# Altium project Zapper.PrjPcb (part 2 of 3)

## Sheet OutputChannel.SchDoc
size A4; DocumentNumber: 5; SheetNumber: 5; SheetTotal: 7
Used 8 times, as channels U_OutputChannel1, U_OutputChannel2, U_OutputChannel3, U_OutputChannel4, U_OutputChannel5, U_OutputChannel6, U_OutputChannel7, U_OutputChannel8. Parts and nets are listed once, with the designators drawn on the sheet.
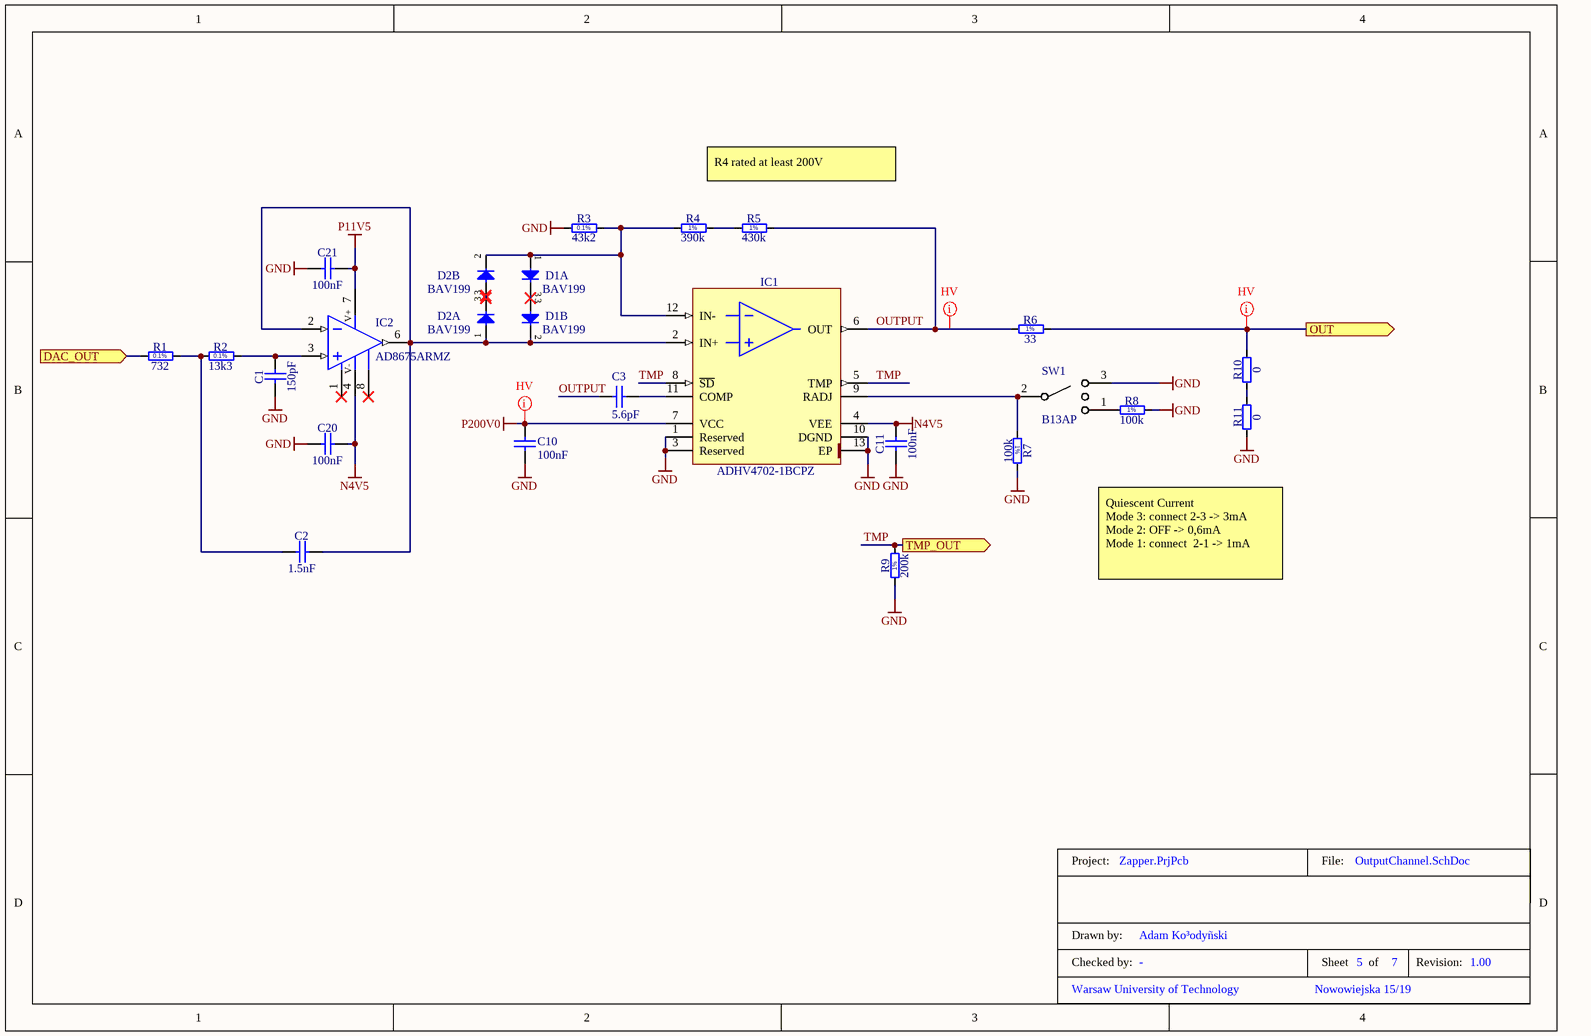
[diagram p4: OutputChannel.SchDoc]

### Parts
C1  150pF  [CAPC1608X87N]
C2  1.5nF  [CAPC1608X87N]
C3  5.6pF  [CAPC2012X95N - HV]
C10  100nF  [CAPC2012X125 - HV]
C11  100nF  [CAPC1005X55N]
C20  100nF  [CAPC1005X55N]
C21  100nF  [CAPC1005X55N]
D1  BAV199  [SOT95P240X110-3N]  (parts A,B of 2)
D2  BAV199  [SOT95P240X110-3N]  (parts A,B of 2)
IC1  ADHV4702-1BCPZ  [QFN170P700X700X80-13N-S290]
IC2  AD8675ARMZ  [SOP65P490X110-8N]
R1  732  [RESC1608X55N]
R2  13k3  [RESC1608X55N]
R3  43k2  [RESC1608X55N]
R4  390k  [RESC2012X60N]
R5  430k  [RESC2012X60N]
R6  33  [RESC1608X55N]
R7  100k  [RESC1608X55N]
R8  100k  [RESC1608X55N]
R9  200k  [RESC1608X55N]
R10  0  [RESC2012X60N]
R11  0  [RESC2012X60N]
SW1  B13AP  [B13AP]
TitleBlock5  TitleBlock  (value not drawn)  (graphical)

### Ports
DAC_OUT (in), OUT (out), TMP_OUT (out)

### Nets
GND: C1.1 C10.1 C11.1 C20.1 C21.1 IC1.1(Reserved) IC1.3(Reserved) IC1.10(DGND) IC1.13(EP) R3.1 R7.2 R8.2 R9.1 R11.1 SW1.3(NC)
N4V5: C11.2 C20.2 IC1.4(VEE) IC2.4(V-)
P11V5: C21.2 IC2.7(V+)
P200V0: C10.2 IC1.7(VCC)
DAC_OUT: R1.1 ; port DAC_OUT
OUT: R6.2 R10.2 ; port OUT
OUTPUT: C3.2 IC1.6(OUT) R5.2 R6.1
TMP: IC1.5(TMP) IC1.8(~{SD}) R9.2 ; port TMP_OUT
NetC1_2: C1.2 IC2.3(IN+) R2.2
NetC2_1: C2.1 R1.2 R2.1
NetC2_2: C2.2 D1.2(C) D2.1(A) IC1.2(IN+) IC2.2(IN-) IC2.6(OUT)
NetC3_1: C3.1 IC1.11(COMP)
NetD1_1: D1.1(A) D2.2(C) IC1.12(IN-) R3.2 R4.1
NetIC1_9: IC1.9(RADJ) R7.1 SW1.2(C)
NetR4_2: R4.2 R5.1
NetR8_1: R8.1 SW1.1(NO)
NetR10_1: R10.1 R11.2

Not connected (* = marked no-connect by the designer): D1 3(COMAC)*; D2 3(COMAC)*; IC2 1(OFFSET)* 8(OFFSET)*

### Channels
U_OutputChannel1: designators end in _U_OutputChannel1; ports DAC_OUT=VOUT1 OUT=Channel_OUT1 TMP_OUT=Channel_TMP1
U_OutputChannel2: designators end in _U_OutputChannel2; ports DAC_OUT=VOUT2 OUT=Channel_OUT2 TMP_OUT=Channel_TMP2
U_OutputChannel3: designators end in _U_OutputChannel3; ports DAC_OUT=VOUT3 OUT=Channel_OUT3 TMP_OUT=Channel_TMP3
U_OutputChannel4: designators end in _U_OutputChannel4; ports DAC_OUT=VOUT4 OUT=Channel_OUT4 TMP_OUT=Channel_TMP4
U_OutputChannel5: designators end in _U_OutputChannel5; ports DAC_OUT=VOUT5 OUT=Channel_OUT5 TMP_OUT=Channel_TMP5
U_OutputChannel6: designators end in _U_OutputChannel6; ports DAC_OUT=VOUT6 OUT=Channel_OUT6 TMP_OUT=Channel_TMP6
U_OutputChannel7: designators end in _U_OutputChannel7; ports DAC_OUT=VOUT7 OUT=Channel_OUT7 TMP_OUT=Channel_TMP7
U_OutputChannel8: designators end in _U_OutputChannel8; ports DAC_OUT=VOUT8 OUT=Channel_OUT8 TMP_OUT=Channel_TMP8

### Layout directives
net class HighVoltage: Channel_OUT1, OUTPUT_U_OutputChannel1, P200V0

### Notes on the sheet
- R4 rated at least 200V
- Quiescent Current                    Mode 3: connect 2-3 -> 3mA   Mode 2: OFF -> 0,6mA               Mode 1: connect  2-1 -> 1mA
- (in symbol R0603_13K3_0.1%_0.063W_10PPM) 0.1%
- (in symbol R0603_33R_1%_0.1W_100PPM) 1%
- (in symbol R0603_43K2_0.1%_0.063W_10PPM) 0.1%
- (in symbol R0603_100K_1%_0.1W_100PPM) 1%
- (in symbol R0603_200K_1%_0.1W_100PPM) 1%
- (in symbol R0603_732R_0.1%_0.063W_10PPM) 0.1%
- (in symbol R0805_390K_1%_0.125W_100PPM) 1%
- (in symbol R0805_430K_1%_0.125W_100PPM) 1%
- (in symbol TitleBlock) Project:; File:; Drawn by:; Checked by:; Sheet; of; Revision:

### Library data of the parts
C1 = CC0603_150PF_50V_1%_NP0: Non-polarised capacitor; Part Description: SMD Multilayer Chip Ceramic Capacitor; Manufacturer: GENERIC; Manufacturer1 Part Number: CC0603FRNPO9BN151; Voltage: 50V; TC: C0G/NP0; Tolerance: ±1%; Part Number: CC0603_150PF_50V_1%_NP0; Component Kind: Standard; Component Type: Standard; Pin Count: 2; Value: 150pF; Status: None; Manufacturer Part Number: CC0603_150PF_50V_1%_NP0; Case: 0603; Mounted: Yes; Socket: No; SMD: Yes; Sense: No; Manufacturer1 Example: PHYCOMP; Manufacturer1 ComponentHeight: 0.7mm; HelpURL: \\cern.ch\dfs\Applications\Altium\Datasheets\CC0805_NP0_PHYCOMP_16VTO50V.pdf; Author: CERN DEM MR; CreateDate: 17.02.2016; LatestRevisionDate: 17.02.2016
C2 = CC0603_1.5NF_50V_10%_X7R: Non-polarised capacitor; Part Description: SMD Multilayer Chip Ceramic Capacitor; Manufacturer: GENERIC; Manufacturer1 Part Number: 223858615625; Voltage: 50V; TC: X7R; Tolerance: ±10%; Part Number: CC0603_1.5NF_50V_10%_X7R; Component Kind: Standard; Component Type: Standard; Pin Count: 2; Value: 1.5nF; Status: Preferred; Manufacturer Part Number: CC0603_1.5NF_50V_10%_X7R; Case: 0603; Mounted: Yes; Socket: No; SMD: Yes; Sense: No; Manufacturer1 Example: PHYCOMP; Manufacturer1 ComponentHeight: 0.87mm; HelpURL: \\cern.ch\dfs\Applications\Altium\Datasheets\CC0603_X7R_PHYCOMP.pdf; Author: CERN DEM JLC; CreateDate: 03.12.2007; LatestRevisionDate: 03.12.2007
C3 = CBR08C569CAGAC: CAP CER 5.6PF 250V C0G/NP0 0805; Manufacturer 1: KEMET; Dielectric: C0G; Supplier 1: Mouser; Manufacturer Part Number 1: CBR08C569CAGAC; Stock 1: 9135; Pricing 1: 1=1,05000, 10=0,74500, 100=0,47000, 500=0,42300, 1000=0,38500, 4000=0,31800 (USD); RoHS: Yes; Mount: Surface Mount; Case/Package: 0805; Weight: 0.000194oz; Case Code (Metric): 2012; Case Code (Imperial): 0805; Min Operating Temperature: -55°C; Max Operating Temperature: 125°C; Packaging: Tape and Reel; Package Quantity: 1; Capacitance: 5.6pF; Voltage Rating: 250V; Voltage Rating (DC): 250V; Termination: SMD/SMT; Length: 0.079inch; Height: 0.85mm; Width: 0.049inch; Thickness: 0.035inch; ComponentLink1URL: https://datasheet.ciiva.com/6258/kem-c1030-cbr-smd-6258011.pdf?src-supplier=Digi-Key; ComponentLink1Description: https://datasheet.ciiva.com/6258/kem-c1030-cbr-smd-6258011.pdf?src-supplier=Digi-Key; ComponentLink2URL: https://datasheet.ciiva.com/6258/kem-c1030-cbr-smd-6258013.pdf?src-supplier=Digi-Key; ComponentLink2Description: https://datasheet.ciiva.com/6258/kem-c1030-cbr-smd-6258013.pdf?src-supplier=Digi-Key; ComponentLink3URL: https://datasheet.ciiva.com/6258/kem-c1030-cbr-smd-6258015.pdf?src-supplier=Digi-Key; ComponentLink3Description: https://datasheet.ciiva.com/6258/kem-c1030-cbr-smd-6258015.pdf?src-supplier=Digi-Key; Supplier Part Number 1: 80-CBR08C569CAG
C10 = C2012X7T2E104K125AA: CAP CER 100nF 250V  TDK         C2012X7T2E104K125AA             SMD Multilayer Ceramic Capacitor, 0805 [2012 Metric], 10%, X7T, C Series                          New; Supplier 1: Digi-Key; Manufacturer 1: TDK; Manufacturer Part Number 1: C2012X7T2E104K125AA; Stock 1: 145107; Pricing 1: 1=0,32000, 10=0,21800, 50=0,14520, 100=0,12340, 500=0,08712, 1000=0,07623 (USD); RoHS: Yes; Mount: Surface Mount; Case/Package: 0805; Case Code (Imperial): 0805; Case Code (Metric): 2012; Min Operating Temperature: -55°C; Max Operating Temperature: 125°C; Dielectric: X7T; Capacitance: 100nF; Tolerance: 10%; Voltage Rating (DC): 250V; Package Quantity: 1; Voltage Rating: 250V; Packaging: Tape and Reel; Length: 2mm; Height: 1.25mm; Thickness: 0.057inch; Depth: 1.25mm; Width: 0.049inch; Radiation Hardening: No; Lead Free: Lead Free; REACH SVHC: No SVHC; ComponentLink1URL: http://components.arrow.com/part/dataview/0323_06886774?src-supplier=Arrow+Europe; ComponentLink1Description: http://components.arrow.com/part/dataview/0323_06886774?src-supplier=Arrow+Europe; ComponentLink2URL: https://product.tdk.com/info/en/catalog/datasheets/mlcc_commercial_midvoltage_en.pdf?src-supplier=Digi-Key; ComponentLink2Description: https://product.tdk.com/info/en/catalog/datasheets/mlcc_commercial_midvoltage_en.pdf?src-supplier=Digi-Key; ComponentLink3URL: http://components.arrow.com/part/dataview/57434366S459809N1165?src-supplier=Arrow; ComponentLink3Description: http://components.arrow.com/part/dataview/57434366S459809N1165?src-supplier=Arrow; ComponentLink4URL: http://product.tdk.com/capacitor/mlcc/en/documents/mlcc_commercial_midvoltage_en.pdf?src-supplier=Avnet; ComponentLink4Description: http://product.tdk.com/capacitor/mlcc/en/documents/mlcc_commercial_midvoltage_en.pdf?src-supplier=Avnet; ComponentLink5URL: http://product.tdk.com/capacitor/mlcc/en/documents/mlcc_commercial_midvoltage_en.pdf?src-supplier=Avnet+Europe; ComponentLink5Description: http://product.tdk.com/capacitor/mlcc/en/documents/mlcc_commercial_midvoltage_en.pdf?src-supplier=Avnet+Europe; ComponentLink6URL: http://www.farnell.com/datasheets/1913358.pdf?src-supplier=Element14; ComponentLink6Description: http://www.farnell.com/datasheets/1913358.pdf?src-supplier=Element14; ComponentLink7URL: https://product.tdk.com/info/en/catalog/spec/mlccspec_commercial_general_midvoltage_en.pdf?src-supplier=Digi-Key; ComponentLink7Description: https://product.tdk.com/info/en/catalog/spec/mlccspec_commercial_general_midvoltage_en.pdf?src-supplier=Digi-Key; ComponentLink8URL: http://www.farnell.com/datasheets/1913358.pdf?src-supplier=Newark; ComponentLink8Description: http://www.farnell.com/datasheets/1913358.pdf?src-supplier=Newark; Supplier Part Number 1: 445-C2012X7T2E104K125AACT-ND
C11 C20 C21 = CC0402_100NF_16V_10%_X7R: Non-polarised capacitor; Part Description: SMD Multilayer Chip Ceramic Capacitor; Manufacturer: GENERIC; Manufacturer1 Part Number: GRM155R71C104KA88D; Voltage: 16V; TC: X7R; Tolerance: ±10%; Part Number: CC0402_100NF_16V_10%_X7R; Component Kind: Standard; Component Type: Standard; Pin Count: 2; Value: 100nF; Status: Not Recommended; Manufacturer Part Number: CC0402_100NF_16V_10%_X7R; Case: 0402; Mounted: Yes; Socket: No; SMD: Yes; Sense: No; Manufacturer1 Example: MURATA; Manufacturer1 ComponentHeight: 0.55mm; HelpURL: \\cern.ch\dfs\Applications\Altium\Datasheets\CC0402_X7R_MURATA_GRM.pdf; Author: CERN DEM JLC; CreateDate: 05.12.2013; LatestRevisionDate: 03.12.2007
D1 D2 = BAV199: Serial Diode; Part Description: Low-Leakage Double Diode; Manufacturer: NXP SEMICONDUCTORS; Voltage: 75V; Power: 250mW; PressFit: No; Bonding: No; Part Number: BAV199; Component Kind: Standard; Component Type: Standard; Device: BAV199; PackageDescription: SOT23 3-Leads, Pitch 0.95mm - Body 1.4x3mm, IPC Medium Density; Manufacturer Part Number: BAV199; Pin Count: 3; Case: SOT23-3; Mounted: Yes; Socket: No; SMD: Yes; Sense: No; ComponentHeight: 1.1mm; HelpURL: \\cern.ch\dfs\Applications\Altium\Datasheets\BAV199.pdf; Author: CERN DEM JMW; CreateDate: 21.11.2008; LatestRevisionDate: 21.11.2008
IC1 = ADHV4702-1BCPZ: 24V to 220V Precision Operational Amplifier; Manufacturer: ANALOG DEVICES; PressFit: No; Bonding: No; Part Number: ADHV4702-1BCPZ; Component Kind: Standard; Component Type: Standard; Device: ADHV4702-1BCPZ; PackageDescription: QFN, 1.70mm Pitch, Square; 12 pin, 7.00mm L X 7.00mm W X 0.80mm H body (w/Thermal Tab 2.9 X 2.9mm), IPC Medium Density; Part Description: 24V to 220V Precision Operational Amplifier; Manufacturer Part Number: ADHV4702-1BCPZ; Pin Count: 13; Case: QFN12; Mounted: Yes; Socket: No; SMD: Yes; Sense: No; ComponentHeight: 0.8mm; Author: CERN DEM BC; HelpURL: \\cern.ch\dfs\Applications\Altium\Datasheets\ADHV4702-1BCPZ.pdf; CreateDate: 29.08.2019; LatestRevisionDate: 29.08.2019
IC2 = AD8675ARMZ: Operational Amplifier with Offset 1-8; Part Description: 36V Precision, 2.8nV/sqrt Hz Rail-to-Rail Output Operational Amplifier; Manufacturer: ANALOG DEVICES; PressFit: No; Bonding: No; Part Number: AD8675ARMZ; Component Kind: Standard; Component Type: Standard; Device: AD8675ARMZ; PackageDescription: SOP, 0.65mm Pitch; 8 Pin, 3.00mm W X 3.00mm L X 1.10mm H body, IPC Medium Density; Manufacturer Part Number: AD8675ARMZ; Pin Count: 8; Case: MSOP8; Mounted: Yes; Socket: No; SMD: Yes; Sense: No; ComponentHeight: 1.1mm; Author: CERN DEM JMW; HelpURL: \\cern.ch\dfs\Applications\Altium\Datasheets\AD8675ARMZ.pdf; CreateDate: 06.09.2011; LatestRevisionDate: 06.09.2011
R1 = R0603_732R_0.1%_0.063W_10PPM: Resistor - 0.1%; Part Description: Thin Film Chip Resistor; Manufacturer: GENERIC; Manufacturer1 Part Number: RN73C1J732RBTDF; Power: 0.063W; TC: ±10ppm; PressFit: No; Part Number: R0603_732R_0.1%_0.063W_10PPM; Component Kind: Standard; Component Type: Standard; Pin Count: 2; Value: 732; Status: Not Recommended; Tolerance: ±0.1%; Manufacturer Part Number: R0603_732R_0.1%_0.063W_10PPM; Case: 0603; Mounted: Yes; Sense: No; Socket: No; SMD: Yes; Manufacturer1 Example: TYCO HOLSWORTHY; Manufacturer1 ComponentHeight: 0.5mm; HelpURL: \\cern.ch\dfs\Applications\Altium\Datasheets\R0603_Tyco_RN73.pdf; Author: CERN DEM JLC; CreateDate: 03.12.2007; LatestRevisionDate: 13.03.2008
R2 = R0603_13K3_0.1%_0.063W_10PPM: Resistor - 0.1%; Part Description: Thin Film Chip Resistor; Manufacturer: GENERIC; Manufacturer1 Part Number: RN73C1J13K3BTDF; Power: 0.063W; TC: ±10ppm; PressFit: No; Part Number: R0603_13K3_0.1%_0.063W_10PPM; Component Kind: Standard; Component Type: Standard; Pin Count: 2; Value: 13k3; Status: Not Recommended; Tolerance: ±0.1%; Manufacturer Part Number: R0603_13K3_0.1%_0.063W_10PPM; Case: 0603; Mounted: Yes; Sense: No; Socket: No; SMD: Yes; Manufacturer1 Example: TYCO HOLSWORTHY; Manufacturer1 ComponentHeight: 0.5mm; HelpURL: \\cern.ch\dfs\Applications\Altium\Datasheets\R0603_Tyco_RN73.pdf; Author: CERN DEM JLC; CreateDate: 03.12.2007; LatestRevisionDate: 13.03.2008
R3 = R0603_43K2_0.1%_0.063W_10PPM: Resistor - 0.1%; Part Description: Thin Film Chip Resistor; Manufacturer: GENERIC; Manufacturer1 Part Number: RN73C1J43K2BTDF; Power: 0.063W; TC: ±10ppm; PressFit: No; Part Number: R0603_43K2_0.1%_0.063W_10PPM; Component Kind: Standard; Component Type: Standard; Pin Count: 2; Value: 43k2; Status: Not Recommended; Tolerance: ±0.1%; Manufacturer Part Number: R0603_43K2_0.1%_0.063W_10PPM; Case: 0603; Mounted: Yes; Sense: No; Socket: No; SMD: Yes; Manufacturer1 Example: TYCO HOLSWORTHY; Manufacturer1 ComponentHeight: 0.5mm; HelpURL: \\cern.ch\dfs\Applications\Altium\Datasheets\R0603_Tyco_RN73.pdf; Author: CERN DEM JLC; CreateDate: 03.12.2007; LatestRevisionDate: 13.03.2008
R4 = R0805_390K_1%_0.125W_100PPM: Resistor - 1%; Part Description: General Purpose Thick Film Chip Resistor; Manufacturer: GENERIC; Manufacturer1 Part Number: NRC10F3903TRF; Power: 0.125W; TC: ±100ppm/°C; PressFit: No; Part Number: R0805_390K_1%_0.125W_100PPM; Component Kind: Standard; Component Type: Standard; Pin Count: 2; Value: 390k; Status: Preferred; Tolerance: ±1%; Manufacturer Part Number: R0805_390K_1%_0.125W_100PPM; Case: 0805; Mounted: Yes; Sense: No; Socket: No; SMD: Yes; Manufacturer1 Example: NIC COMPONENT; Manufacturer1 ComponentHeight: 0.6mm; HelpURL: \\cern.ch\dfs\Applications\Altium\Datasheets\R0805_NIC_NRC.pdf; Author: CERN DEM JLC; CreateDate: 03.12.2007; LatestRevisionDate: 13.03.2008
R5 = R0805_430K_1%_0.125W_100PPM: Resistor - 1%; Part Description: General Purpose Thick Film Chip Resistor; Manufacturer: GENERIC; Manufacturer1 Part Number: NRC10F4303TRF; Power: 0.125W; TC: ±100ppm/°C; PressFit: No; Part Number: R0805_430K_1%_0.125W_100PPM; Component Kind: Standard; Component Type: Standard; Pin Count: 2; Value: 430k; Status: Preferred; Tolerance: ±1%; Manufacturer Part Number: R0805_430K_1%_0.125W_100PPM; Case: 0805; Mounted: Yes; Sense: No; Socket: No; SMD: Yes; Manufacturer1 Example: NIC COMPONENT; Manufacturer1 ComponentHeight: 0.6mm; HelpURL: \\cern.ch\dfs\Applications\Altium\Datasheets\R0805_NIC_NRC.pdf; Author: CERN DEM JLC; CreateDate: 03.12.2007; LatestRevisionDate: 13.03.2008
R6 = R0603_33R_1%_0.1W_100PPM: Resistor - 1%; Part Description: General Purpose Thick Film Chip Resistor; Manufacturer: GENERIC; Manufacturer1 Part Number: NRC06F33R0TRF; Power: 0.1W; TC: ±100ppm/°C; PressFit: No; Part Number: R0603_33R_1%_0.1W_100PPM; Component Kind: Standard; Component Type: Standard; Pin Count: 2; Value: 33; Status: Preferred; Tolerance: ±1%; Manufacturer Part Number: R0603_33R_1%_0.1W_100PPM; Case: 0603; Mounted: Yes; Sense: No; Socket: No; SMD: Yes; Manufacturer1 Example: NIC COMPONENT; Manufacturer1 ComponentHeight: 0.55mm; HelpURL: \\cern.ch\dfs\Applications\Altium\Datasheets\R0603_NIC_NRC.pdf; Author: CERN DEM JLC; CreateDate: 03.12.2007; LatestRevisionDate: 13.03.2008
R7 R8 = R0603_100K_1%_0.1W_100PPM: Resistor - 1%; Part Description: General Purpose Thick Film Chip Resistor; Manufacturer: GENERIC; Manufacturer1 Part Number: NRC06F1003TRF; Power: 0.1W; TC: ±100ppm/°C; PressFit: No; Part Number: R0603_100K_1%_0.1W_100PPM; Component Kind: Standard; Component Type: Standard; Pin Count: 2; Value: 100k; Status: Preferred; Tolerance: ±1%; Manufacturer Part Number: R0603_100K_1%_0.1W_100PPM; Case: 0603; Mounted: Yes; Sense: No; Socket: No; SMD: Yes; Manufacturer1 Example: NIC COMPONENT; Manufacturer1 ComponentHeight: 0.55mm; HelpURL: \\cern.ch\dfs\Applications\Altium\Datasheets\R0603_NIC_NRC.pdf; Author: CERN DEM JLC; CreateDate: 03.12.2007; LatestRevisionDate: 13.03.2008
R9 = R0603_200K_1%_0.1W_100PPM: Resistor - 1%; Part Description: General Purpose Thick Film Chip Resistor; Manufacturer: GENERIC; Manufacturer1 Part Number: NRC06F2003TRF; Power: 0.1W; TC: ±100ppm/°C; PressFit: No; Part Number: R0603_200K_1%_0.1W_100PPM; Component Kind: Standard; Component Type: Standard; Pin Count: 2; Value: 200k; Status: Preferred; Tolerance: ±1%; Manufacturer Part Number: R0603_200K_1%_0.1W_100PPM; Case: 0603; Mounted: Yes; Sense: No; Socket: No; SMD: Yes; Manufacturer1 Example: NIC COMPONENT; Manufacturer1 ComponentHeight: 0.55mm; HelpURL: \\cern.ch\dfs\Applications\Altium\Datasheets\R0603_NIC_NRC.pdf; Author: CERN DEM JLC; CreateDate: 03.12.2007; LatestRevisionDate: 13.03.2008
R10 R11 = R0805_0R_JUMPER: Resistor; Part Description: 2A (0.05R Max DC Resistance) Zero Ohm Jumper; Manufacturer: GENERIC; Manufacturer1 Part Number: NRC10Z0; PressFit: No; Part Number: R0805_0R_JUMPER; Component Kind: Standard; Component Type: Standard; Pin Count: 2; Value: 0; Status: Preferred; Manufacturer Part Number: R0805_0R_JUMPER; Case: 0805; Mounted: Yes; Sense: No; Socket: No; SMD: Yes; Manufacturer1 Example: NIC COMPONENT; Manufacturer1 ComponentHeight: 0.6mm; HelpURL: \\cern.ch\dfs\Applications\Altium\Datasheets\R0805_NIC_NRC.pdf; Author: CERN DEM JLC; CreateDate: 03.12.2007; LatestRevisionDate: 13.03.2008
SW1 = B13AP: Switch;  Sealed;  Anti-Static Toggle;  SPDT;  ON-OFF-ON;  Str PC;  No Cap;  0.4A;  28VAC/DC; Manufacturer 1: NKK Switches; Actuator Material: Brass; Voltage Rating (AC): 28V; Current Rating: 100mA; Power Rating: 400mW; Illumination Type: Non-Illuminated,Illuminated; Electrical Life: 50000Cycles; Actuator Type: Standard Round; Actuator Length: 10mm; Supplier 1: Digi-Key; Manufacturer Part Number 1: B13AP; Stock 1: 542; Pricing 1: 1=3,70000, 10=3,31100, 25=3,14160, 50=2,98760, 100=2,84900, 250=2,72580, 500=2,49480, 1000=2,37160 (USD); RoHS: Yes; Mount: Through Hole,PCB; Number of Pins: 1; Contact Plating: Gold; Contact Material: Bronze,Gold; Min Operating Temperature: -30°C; Max Operating Temperature: 85°C; Throw Configuration: SPDT; Packaging: Bulk; Voltage Rating (DC): 28V; Orientation: Vertical; Package Quantity: 1; Switch Function: On-Off-On; Termination: Solder; Max Current Rating: 100mA; Max Voltage Rating (AC): 28V; Max Voltage Rating (DC): 28V; Contact Current Rating: 100mA; Length: 8.8mm; Depth: 6.8mm; Lead Free: Lead Free; REACH SVHC: No SVHC; ComponentLink1URL: https://datasheet.ciiva.com/5287/btoggles-28447-5287190.pdf?src-supplier=Mouser; ComponentLink1Description: https://datasheet.ciiva.com/5287/btoggles-28447-5287190.pdf?src-supplier=Mouser; ComponentLink2URL: https://datasheet.ciiva.com/14542/70192333-14542216.pdf?src-supplier=Allied+Electronics; ComponentLink2Description: https://datasheet.ciiva.com/14542/70192333-14542216.pdf?src-supplier=Allied+Electronics; Supplier Part Number 1: 360-1013-ND

## Sheet PowerSupp.SchDoc
size A3; DocumentNumber: 4; SheetNumber: 4; SheetTotal: 7
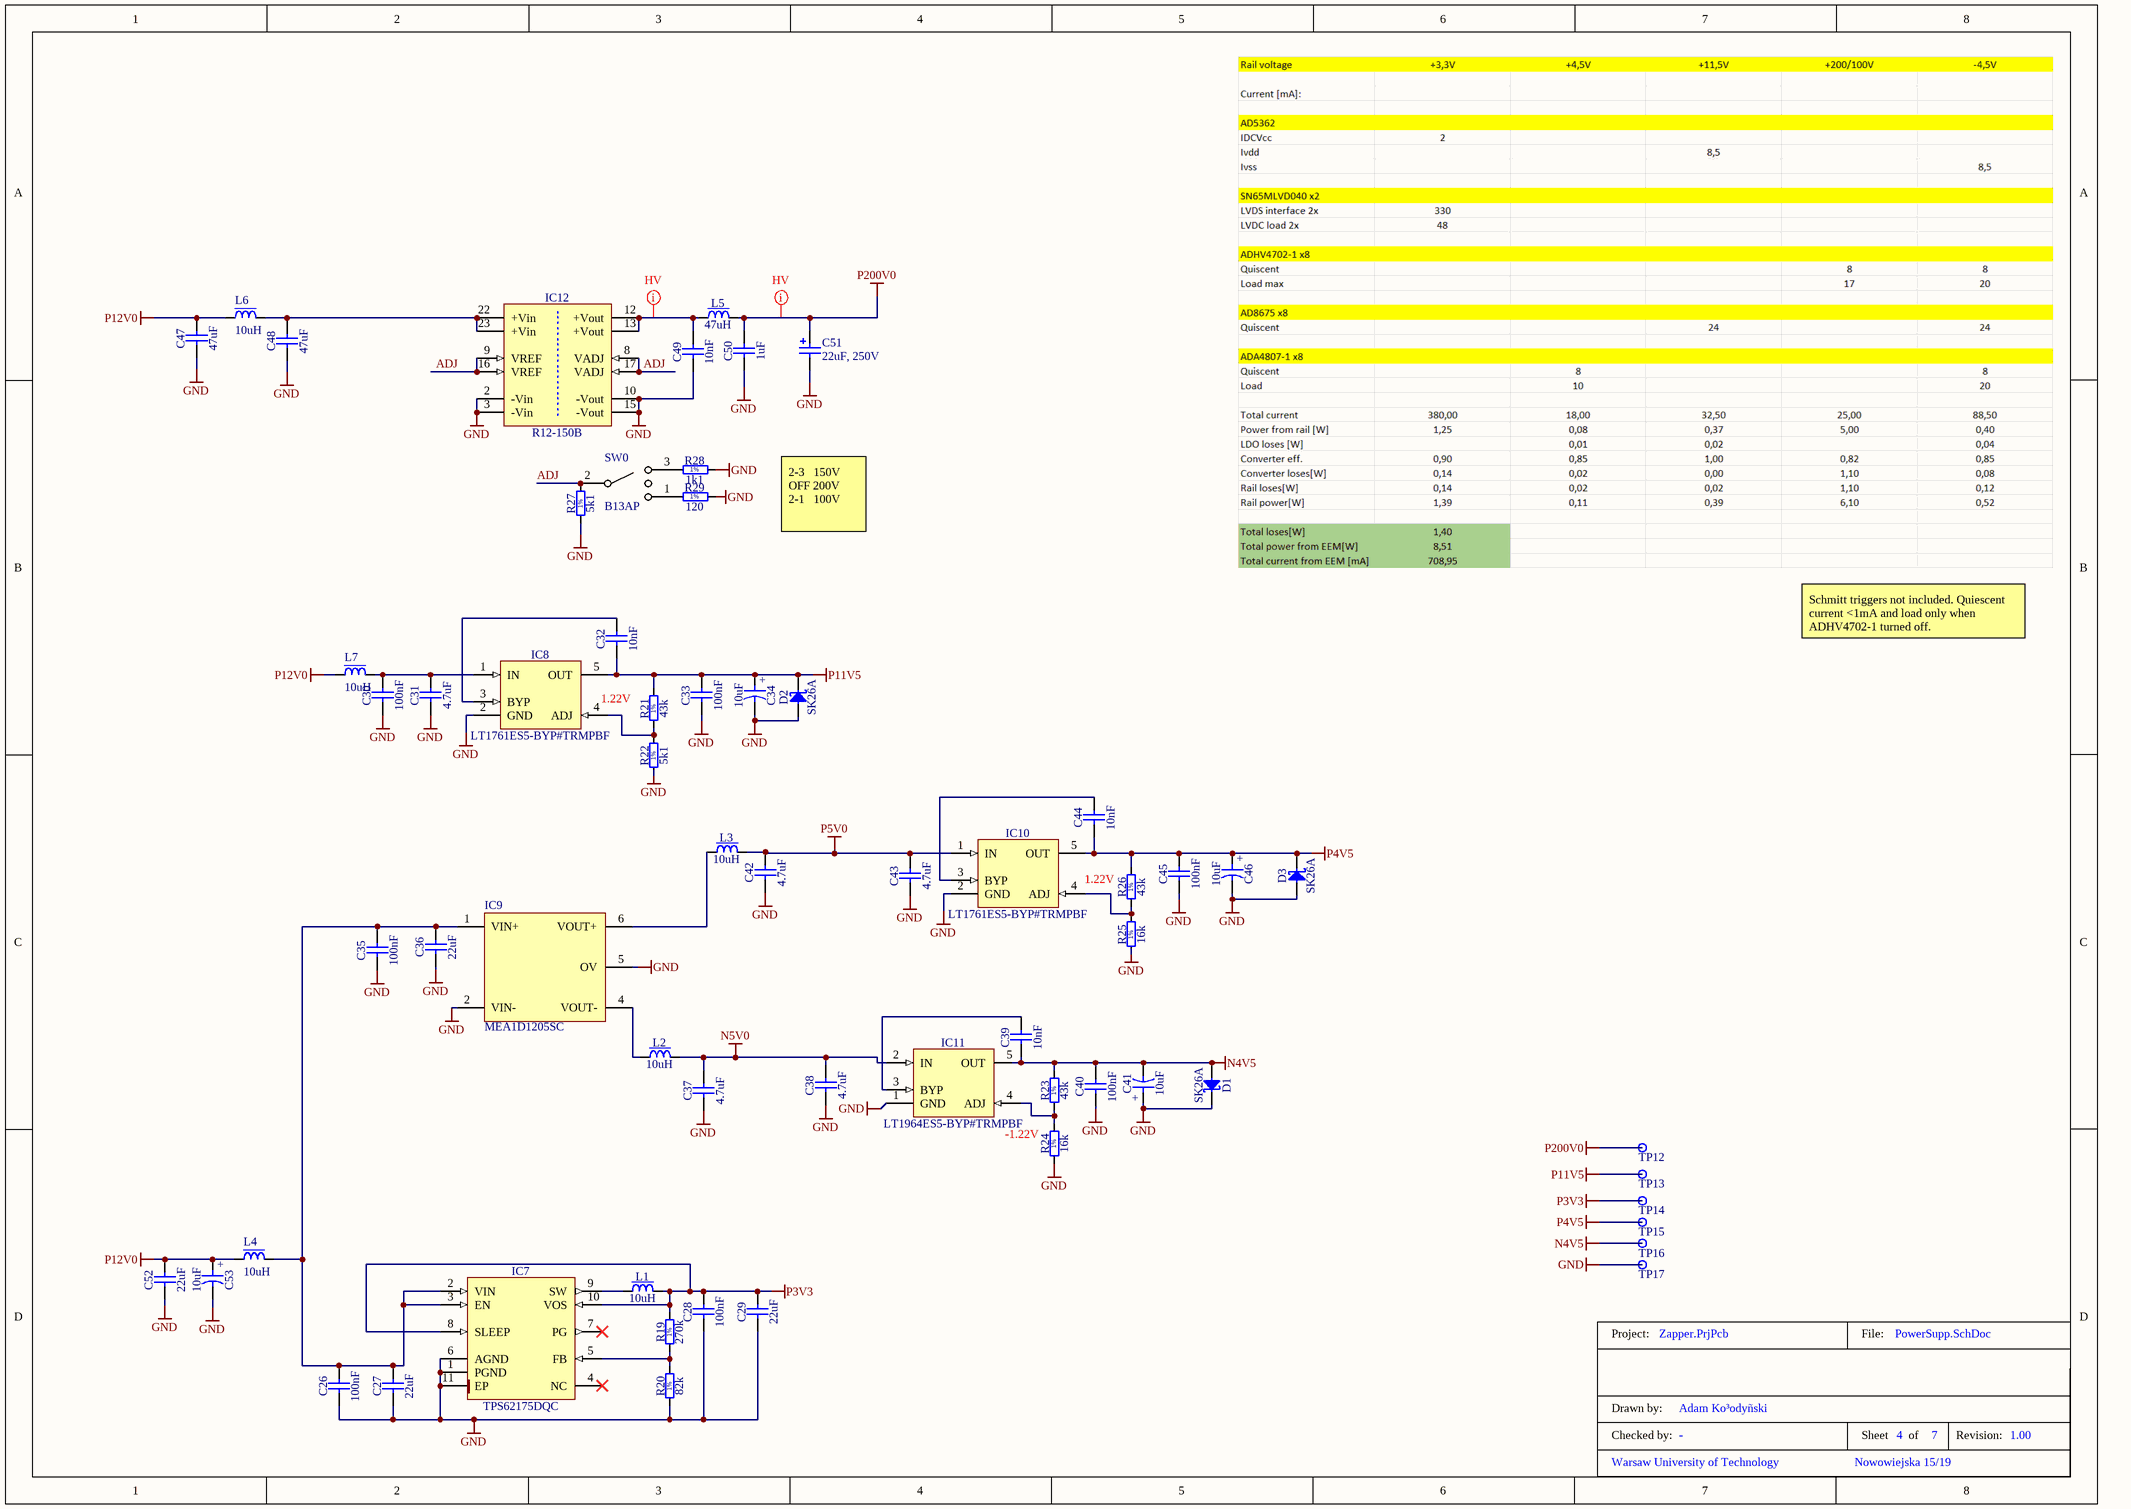
[diagram p5: PowerSupp.SchDoc]

### Parts
C26  100nF  [CAPC1005X55N]
C27  22uF  [CAPC2012X135N]
C28  100nF  [CAPC1005X55N]
C29  22uF  [CAPC2012X135N]
C30  100nF  [CAPC1005X55N]
C31  4.7uF  [CAPC2012X135N]
C32  10nF  [CAPC1608X87N]
C33  100nF  [CAPC1005X55N]
C34  10uF  [CAPMP3528X210N]
C35  100nF  [CAPC1005X55N]
C36  22uF  [CAPC2012X135N]
C37  4.7uF  [CAPC2012X135N]
C38  4.7uF  [CAPC2012X135N]
C39  10nF  [CAPC1608X87N]
C40  100nF  [CAPC1005X55N]
C41  10uF  [CAPMP3528X210N]
C42  4.7uF  [CAPC2012X135N]
C43  4.7uF  [CAPC2012X135N]
C44  10nF  [CAPC1608X87N]
C45  100nF  [CAPC1005X55N]
C46  10uF  [CAPMP3528X210N]
C47  47uF  [CAPC5750X200N]
C48  47uF  [CAPC5750X200N]
C49  10nF  [CAPC3216X88N]
C50  1uF  [CAPC5750X270N]
C51  22uF, 250V  [WCAP-AT1H_13x20]
C52  22uF  [CAPC2012X135N]
C53  10uF  [CAPMP3528X210N]
D1  SK26A  [DIOM5126X265N]
D2  SK26A  [DIOM5126X265N]
D3  SK26A  [DIOM5126X265N]
IC7  TPS62175DQC  [SON50P200X300X80-11N-R94X250]
IC8  LT1761ES5-BYP#TRMPBF  [SOT95P280X100-5N]
IC9  MEA1D1205SC  [MURA-SIP-5_V]
IC10  LT1761ES5-BYP#TRMPBF  [SOT95P280X100-5N]
IC11  LT1964ES5-BYP#TRMPBF  [SOT95P280X100-5N]
IC12  R12-150B  [DCDC_RECOM_Rxx-B]
L1  10uH  [IND_MURATA-PS_8400]
L2  10uH  [IND_MURATA-PS_8400]
L3  10uH  [IND_MURATA-PS_8400]
L4  10uH  [IND_MURATA-PS_8400]
L5  47uH  [IND_MURATA-PS_8400]
L6  10uH  [IND_MURATA-PS_8400]
L7  10uH  [IND_MURATA-PS_8400]
R19  270k  [RESC1608X55N]
R20  82k  [RESC1608X55N]
R21  43k  [RESC1608X55N]
R22  5k1  [RESC1608X55N]
R23  43k  [RESC1608X55N]
R24  16k  [RESC1608X55N]
R25  16k  [RESC1608X55N]
R26  43k  [RESC1608X55N]
R27  5k1  [RESC1608X55N]
R28  1k1  [RESC1608X55N]
R29  120  [RESC1608X55N]
SW0  B13AP  [B13AP]
TitleBlock4  TitleBlock  (value not drawn)  (graphical)
TP12  Test Point  [TPS127]  (value not drawn)
TP13  Test Point  [TPS127]  (value not drawn)
TP14  Test Point  [TPS127]  (value not drawn)
TP15  Test Point  [TPS127]  (value not drawn)
TP16  Test Point  [TPS127]  (value not drawn)
TP17  Test Point  [TPS127]  (value not drawn)

### Nets
GND: C26.1 C27.1 C28.1 C29.1 C30.1 C31.1 C33.1 C34.2 C35.1 C36.1 C37.1 C38.1 C40.1 C41.1 C42.1 C43.1 C45.1 C46.2 C47.1 C48.1 C49.1 C50.1 C51.1(N) C52.1 C53.2 D1.1(C) D2.2(A) D3.2(A) IC7.1(PGND) IC7.6(AGND) IC7.11(EP) IC8.2(GND) IC9.2(VIN-) IC9.5(OV) IC10.2(GND) IC11.1(GND) IC12.2(-Vin) IC12.3(-Vin) IC12.10(-Vout) IC12.15(-Vout) R20.1 R22.1 R24.1 R25.1 R27.1 R28.2 R29.2 TP17.1
N4V5: C39.1 C40.2 C41.2 D1.2(A) IC11.5(OUT) R23.2 TP16.1
N5V0: C37.2 C38.2 IC11.2(IN) L2.2
P3V3: C28.2 C29.2 IC7.8(SLEEP) IC7.10(VOS) L1.2 R19.2 TP14.1
P4V5: C44.1 C45.2 C46.1 D3.1(C) IC10.5(OUT) R26.2 TP15.1
P5V0: C42.2 C43.2 IC10.1(IN) L3.2
P11V5: C32.1 C33.2 C34.1 D2.1(C) IC8.5(OUT) R21.2 TP13.1
P12V0: C47.2 C52.2 C53.1 L4.1 L6.1 L7.1
P200V0: C50.2 C51.2(P) L5.2 TP12.1
ADJ: IC12.8(VADJ) IC12.9(VREF) IC12.16(VREF) IC12.17(VADJ) R27.2 SW0.2(C)
NetC26_2: C26.2 C27.2 C35.2 C36.2 IC7.2(VIN) IC7.3(EN) IC9.1(VIN+) L4.2
NetC30_2: C30.2 C31.2 IC8.1(IN) L7.2
NetC32_2: C32.2 IC8.3(BYP)
NetC39_2: C39.2 IC11.3(BYP)
NetC44_2: C44.2 IC10.3(BYP)
NetC48_2: C48.2 IC12.22(+Vin) IC12.23(+Vin) L6.2
NetC49_2: C49.2 IC12.12(+Vout) IC12.13(+Vout) L5.1
NetIC7_5: IC7.5(FB) R19.1 R20.2
NetIC7_9: IC7.9(SW) L1.1
NetIC8_4: IC8.4(ADJ) R21.1 R22.2
NetIC9_4: IC9.4(VOUT-) L2.1
NetIC9_6: IC9.6(VOUT+) L3.1
NetIC10_4: IC10.4(ADJ) R25.2 R26.1
NetIC11_4: IC11.4(ADJ) R23.1 R24.2
NetR28_1: R28.1 SW0.3(NC)
NetR29_1: R29.1 SW0.1(NO)

Not connected (* = marked no-connect by the designer): IC7 4(NC)* 7(PG)*

### Layout directives
net class HighVoltage: NetC49_2, P200V0

### Notes on the sheet
- 2-3   150V OFF 200V  2-1   100V
- Schmitt triggers not included. Quiescent current <1mA and load only when ADHV4702-1 turned off.
- 1.22V
- (near R24) -1.22V
- (in symbol CTE3528-21_10UF_16V_20%_PANASONIC_TQC) +
- (in symbol R0603_1K1_1%_0.1W_100PPM) 1%
- (in symbol R0603_5K1_1%_0.1W_100PPM) 1%
- (in symbol R0603_16K_1%_0.1W_100PPM) 1%
- (in symbol R0603_43K_1%_0.1W_100PPM) 1%
- (in symbol R0603_82K_1%_0.1W_100PPM) 1%
- (in symbol R0603_120R_1%_0.1W_100PPM) 1%
- (in symbol R0603_270K_1%_0.1W_100PPM) 1%
- (in symbol TitleBlock) Project:; File:; Drawn by:; Checked by:; Sheet; of; Revision:

### Library data of the parts
C26 C28 C30 C33 C35 C40 C45 = CC0402_100NF_16V_10%_X7R: as C11 on sheet OutputChannel; Part Number: CC0402_100NF_16V_10%_X7R; Component Kind: Standard; Component Type: Standard; Pin Count: 2; Value: 100nF; Status: Not Recommended; Manufacturer Part Number: CC0402_100NF_16V_10%_X7R; Case: 0402; Mounted: Yes; Socket: No; SMD: Yes; Sense: No; Manufacturer1 Example: MURATA; Manufacturer1 ComponentHeight: 0.55mm; HelpURL: \\cern.ch\dfs\Applications\Altium\Datasheets\CC0402_X7R_MURATA_GRM.pdf; Author: CERN DEM JLC; CreateDate: 05.12.2013; LatestRevisionDate: 03.12.2007
C27 C29 C36 C52 = CC0805_22UF_16V_10%_X5R: Non-polarised capacitor; Part Description: SMD Multilayer Chip Ceramic Capacitor; Manufacturer: GENERIC; Manufacturer1 Part Number: C2012X5R1C226KT; Voltage: 16V; TC: X5R; Tolerance: ±10%; Part Number: CC0805_22UF_16V_10%_X5R; Component Kind: Standard; Component Type: Standard; Pin Count: 2; Value: 22uF; Status: Preferred; Manufacturer Part Number: CC0805_22UF_16V_10%_X5R; Case: 0805; Mounted: Yes; Socket: No; SMD: Yes; Sense: No; Manufacturer1 Example: TDK; Manufacturer1 ComponentHeight: 1.35mm; HelpURL: \\cern.ch\dfs\Applications\Altium\Datasheets\CC0805_X5R_TDK_C.pdf; Author: CERN DEM JLC; CreateDate: 25.10.2012; LatestRevisionDate: 25.10.2012
C31 C37 C38 C42 C43 = CC0805_4.7UF_16V_10%_X7R: Non-polarised capacitor; Part Description: SMD Multilayer Chip Ceramic Capacitor; Manufacturer: GENERIC; Manufacturer1 Part Number: EMK212B7475KG-T; Voltage: 16V; TC: X7R; Tolerance: ±10%; Part Number: CC0805_4.7UF_16V_10%_X7R; Component Kind: Standard; Component Type: Standard; Pin Count: 2; Value: 4.7uF; Status: Preferred; Manufacturer Part Number: CC0805_4.7UF_16V_10%_X7R; Case: 0805; Mounted: Yes; Socket: No; SMD: Yes; Sense: No; Manufacturer1 Example: TAIYO YUDEN; Manufacturer1 ComponentHeight: 1.35mm; HelpURL: \\cern.ch\dfs\Applications\Altium\Datasheets\CC0805_X7R_TAIYO-YUDEN_HIGH-VALUE.pdf; Author: CERN DEM JLC; CreateDate: 16.09.2014; LatestRevisionDate: 16.09.2014
C32 C39 C44 = CC0603_10NF_50V_10%_X7R: Non-polarised capacitor; Part Description: SMD Multilayer Chip Ceramic Capacitor; Manufacturer: GENERIC; Manufacturer1 Part Number: 223858615636; Voltage: 50V; TC: X7R; Tolerance: ±10%; Part Number: CC0603_10NF_50V_10%_X7R; Component Kind: Standard; Component Type: Standard; Pin Count: 2; Value: 10nF; Status: Preferred; Manufacturer Part Number: CC0603_10NF_50V_10%_X7R; Case: 0603; Mounted: Yes; Socket: No; SMD: Yes; Sense: No; Manufacturer1 Example: PHYCOMP; Manufacturer1 ComponentHeight: 0.87mm; HelpURL: \\cern.ch\dfs\Applications\Altium\Datasheets\CC0603_X7R_PHYCOMP.pdf; Author: CERN DEM JLC; CreateDate: 03.12.2007; LatestRevisionDate: 03.12.2007
C34 C41 C46 C53 = CTE3528-21_10UF_16V_20%_PANASONIC_TQC: Polarised capacitor; Part Description: ESR 0R1 Solid Tantalum Chip Capacitor; Manufacturer Part Number: 16TQC10M; Voltage: 16V; Tolerance: ±20%; Part Number: CTE3528-21_10UF_16V_20%_PANASONIC_TQC; Component Kind: Standard; Component Type: Standard; Pin Count: 2; Value: 10uF; Status: None; Manufacturer: PANASONIC; Case: B; Mounted: Yes; Socket: No; SMD: Yes; Sense: No; ComponentHeight: 2mm; HelpURL: \\cern.ch\dfs\Applications\Altium\Datasheets\CTE_PANASONIC_TQC.pdf; Author: CERN DEM JLC; CreateDate: 01.09.2014; LatestRevisionDate: 01.09.2014
C47 C48 = CC2220_47UF_16V_20%_X7R: Non-polarised capacitor; Part Description: Multilayer Ceramic Chip Capacitor; Manufacturer: GENERIC; Manufacturer1 Part Number: C5750X7R1C476M230KB; Voltage: 16V; TC: X7R; Tolerance: ±20%; Part Number: CC2220_47UF_16V_20%_X7R; Component Kind: Standard; Component Type: Standard; Pin Count: 2; Value: 47uF; Status: None; Manufacturer Part Number: CC2220_47UF_16V_20%_X7R; Case: 2220; Mounted: Yes; Socket: No; SMD: Yes; Sense: No; Manufacturer1 Example: TDK; Manufacturer1 ComponentHeight: 2.5mm; HelpURL: \\cern.ch\dfs\Applications\Altium\Datasheets\CC2220_X7R_TDK_C.pdf; Author: CERN DEM JLC; CreateDate: 31.01.2017; LatestRevisionDate: 31.01.2017
C49 = CC1206_10NF_250V_10%_X7R: Non-polarised capacitor; Part Description: SMD Multilayer Chip Ceramic Capacitor; Manufacturer: GENERIC; Manufacturer1 Part Number: C1206C103KARACTU; Voltage: 250V; TC: X7R; Tolerance: ±10%; Part Number: CC1206_10NF_250V_10%_X7R; Component Kind: Standard; Component Type: Standard; Pin Count: 2; Value: 10nF; Status: None; Manufacturer Part Number: CC1206_10NF_250V_10%_X7R; Case: 1206; Mounted: Yes; Socket: No; SMD: Yes; Sense: No; Manufacturer1 Example: KEMET; Manufacturer1 ComponentHeight: 0.88mm; HelpURL: \\cern.ch\dfs\Applications\Altium\Datasheets\CC1206_X7R_KEMET.pdf; Author: CERN DEM MR; CreateDate: 30.05.2018; LatestRevisionDate: 30.05.2018
C50 = CC2220_1UF_250V_10%_X7T_MURATA_GC355XD72E105KX05L: Non-polarised capacitor; Part Description: High Ripple Current Chip Monolithic Ceramic Capacitors for Automotive; Manufacturer: MURATA; Voltage: 250V; TC: X7T; Tolerance: ±10%; Part Number: CC2220_1UF_250V_10%_X7T_MURATA_GC355XD72E105KX05L; Component Kind: Standard; Component Type: Standard; Pin Count: 2; Value: 1uF; Status: None; Manufacturer Part Number: GC355XD72E105KX05L; Case: 2220; Mounted: Yes; Socket: No; SMD: Yes; Sense: No; ComponentHeight: 2.7mm; HelpURL: \\cern.ch\dfs\Applications\Altium\Datasheets\CC2220_MURATA_GC355XD72E105KX05L.pdf; Author: CERN DEM JLC; CreateDate: 09.05.2017; LatestRevisionDate: 09.05.2017
C51 = 860241178002: WCAP-AT1H Aluminum Electrolytic Capacitor, Radial, THT, D13xH20mm, 22uF, 250V; Manufacturer: Wurth Elektronik; Dissipation Factor: 15%; Endurance: 10000h; Leakage Current: 320uA; Ripple Current: 490mA; Capacitance Tolerance: +/-20%; Rated Voltage: 250VDC; Technical Reference: ATJI200220M250DSPACK000; ComponentLink1Description: Manufacturer; ComponentLink1URL: http://www.we-online.de; ComponentLink2Description: Datasheet; ComponentLink2URL: https://www.we-online.com/catalog/datasheet/860241178002.pdf; Height: 20mm; Mounting Technology: THT; Operating Temperature: -25 to +105degC; Packaging: Ammo Pack; Published Date: May 2020; Capacitance: 22uF; Diameter: 13mm; Manufacturer Part Number: 860241178002
D1-D3 = SK26A: Schottky Diode; Part Description: 2A, 60V Surface Mount Schottky Barrier Rectifier; Manufacturer: TAIWAN SEMICONDUCTOR; Voltage: 60V; Power: 2A; PressFit: No; Bonding: No; Part Number: SK26A; Component Kind: Standard; Component Type: Standard; Device: SK26A; PackageDescription: DO-214-AC/SMA Molded Diode, 2-Leads, Body 5.1x2.6mm, IPC Medium Density; Manufacturer Part Number: SK26A; Pin Count: 2; Case: DO-214AC; Mounted: Yes; Socket: No; SMD: Yes; Sense: No; ComponentHeight: 2.5mm; HelpURL: \\cern.ch\dfs\Applications\Altium\Datasheets\SK26A.pdf; Author: CERN DEM JMW; CreateDate: 07.08.2015; LatestRevisionDate: 07.08.2015
IC7 = TPS62175DQC: 4.75-28VDC to 1-6VDC, 500mA Step-Down Converter With Sleep Mode; Manufacturer: TEXAS INSTRUMENTS; PressFit: No; Bonding: No; Part Number: TPS62175DQC; Component Kind: Standard; Component Type: Standard; Device: TPS62175DQC; PackageDescription: SON, 10-Leads, Body 2x3mm, Pitch 0.5mm, Thermal Pad 0.94x2.5mm, IPC Medium Density; Part Description: 4.75-28VDC to 1-6VDC, 500mA Step-Down Converter With Sleep Mode; Manufacturer Part Number: TPS62175DQC; Pin Count: 11; Case: SON10; Mounted: Yes; Socket: No; SMD: Yes; Sense: No; ComponentHeight: 0.8mm; HelpURL: \\cern.ch\dfs\Applications\Altium\Datasheets\TPS62175DQC.pdf; Author: CERN DEM JMW; CreateDate: 11.08.2015; LatestRevisionDate: 11.08.2015
IC8 IC10 = LT1761ES5-BYP#TRMPBF: 100mA, Low Noise, LDO Micropower Adjustable Regulator in SOT-23; Part Description: 1.22V to 20V, 100mA, Low Noise, LDO Adjustable Micropower Regulator; Manufacturer: LINEAR TECHNOLOGY; PressFit: No; Bonding: No; Part Number: LT1761ES5-BYP#TRMPBF; Component Kind: Standard; Component Type: Standard; Device: LT1761ES5-BYP#TRMPBF; PackageDescription: SOT23, 0.95mm pitch; 5 pin, 1.6mm W X 2.9mm L, IPC Medium Density; Manufacturer Part Number: LT1761ES5-BYP#TRMPBF; Pin Count: 5; Case: SOT23; Mounted: Yes; Socket: No; SMD: Yes; Sense: No; ComponentHeight: 1mm; HelpURL: \\cern.ch\dfs\Applications\Altium\Datasheets\LT1761ES5-SD#TRMPBF.pdf; Author: CERN DEM MR; CreateDate: 17.02.2016; LatestRevisionDate: 17.02.2016
IC9 = MEA1D1205SC: Module DC-DC 2-OUT 5V/-5V 0.1A/-0.1A 1W 5-Pin SIP Tube; Manufacturer 1: Murata; Number of Outputs: 2; Max Input Voltage (DC): 13.2V; Min Input Voltage (DC): 10.8V; Nominal Output Voltage: -5V; Max Output Current: 100mA; Efficiency: 85%; Voltage - Output 1: 5V; Isolation Voltage: 1kV; Nominal Input Voltage: 12V; Isolation: Isolated; Supplier 1: Mouser; Manufacturer Part Number 1: MEA1D1205SC; Stock 1: 75; Pricing 1: 1=5,39000, 5=5,33000, 10=5,25000, 25=4,96000, 50=4,84000, 100=4,60000 (USD); RoHS: Yes; Mount: Through Hole; Case/Package: SIP; Number of Pins: 5; Min Operating Temperature: -40°C; Max Operating Temperature: 85°C; Output Power: 1W; Packaging: Rail/Tube; Package Quantity: 25; Max Power Dissipation: 1W; Max Input Voltage: 13.2V; Min Input Voltage: 10.8V; Voltage - Output 2: -5V; Output Current: 100mA; Output Voltage: 5V; Current - Output 1: 100mA; Current - Output 2: 100mA; Max Output Power: 1W; Length: 19.65mm; Height: 0.4inch; Depth: 6.15mm; Width: 0.24inch; Radiation Hardening: No; REACH SVHC: No SVHC; ComponentLink1URL: https://datasheet.ciiva.com/11837/0900766b80dc6287-11837761.pdf?src-supplier=RSComponents; ComponentLink1Description: https://datasheet.ciiva.com/11837/0900766b80dc6287-11837761.pdf?src-supplier=RSComponents; ComponentLink2URL: https://datasheet.ciiva.com/26329/158005-da-01-en-dc-dc-wandler-mea1d1205sc-mps-26329995.pdf?src-supplier=Conrad; ComponentLink2Description: https://datasheet.ciiva.com/26329/158005-da-01-en-dc-dc-wandler-mea1d1205sc-mps-26329995.pdf?src-supplier=Conrad; ComponentLink3URL: https://datasheet.ciiva.com/17329/kdc-mea-17329820.pdf?src-supplier=Avnet+Europe; ComponentLink3Description: https://datasheet.ciiva.com/17329/kdc-mea-17329820.pdf?src-supplier=Avnet+Europe; ComponentLink4URL: https://datasheet.ciiva.com/8218/kdc-mea-8218205.pdf?src-supplier=Avnet; ComponentLink4Description: https://datasheet.ciiva.com/8218/kdc-mea-8218205.pdf?src-supplier=Avnet; Supplier Part Number 1: 580-MEA1D1205SC
IC11 = LT1964ES5-BYP#TRMPBF: 200mA, Low Noise, Low Dropout Negative Micropower Regulator; Part Description: -1.22V to -20V, 200mA, Low Noise, Low Dropout Negative Micropower Regulator; Manufacturer: LINEAR TECHNOLOGY; PressFit: No; Bonding: No; Part Number: LT1964ES5-BYP#TRMPBF; Component Kind: Standard; Component Type: Standard; Device: LT1964ES5-BYP#TRMPBF; PackageDescription: SOT23, 0.95mm pitch; 5 pin, 1.75mm W X 3.00mm L, IPC Medium Density; Manufacturer Part Number: LT1964ES5-BYP#TRMPBF; Pin Count: 5; Case: SOT23-5; Mounted: Yes; Socket: No; SMD: Yes; Sense: No; ComponentHeight: 1mm; HelpURL: \\cern.ch\dfs\Applications\Altium\Datasheets\LT1964ES5-BYP#TRMPBF.pdf; Author: CERN DEM MR; CreateDate: 17.02.2016; LatestRevisionDate: 17.02.2016
IC12 = R12-150B: RECOM, Rxx-B Series, Single Output DCDC Converter; Part Description: 10-14VDC to 92-200VDC, 3kVDC Isolated, 5W DC-DC Converter; PressFit: No; Bonding: No; Part Number: R12-150B; Component Kind: Standard; Component Type: Standard; Device: R12-150B; PackageDescription: Rxx-B Series, Body 31.8x20.3mm, DIP24 Package; Manufacturer: RECOM; Manufacturer Part Number: R12-150B; Pin Count: 12; Mounted: Yes; Socket: No; SMD: No; Sense: No; ComponentHeight: 9.9mm; HelpURL: \\cern.ch\dfs\Applications\Altium\Datasheets\R12-150B.pdf; Author: CERN DEM MR; CreateDate: 29.08.2019; LatestRevisionDate: 29.08.2019
L1-L4 L6 L7 = IND_10UH_10%_MURATA-PS_8400: Inductor With Core; Part Description: Miniature Surface Mount Power Inductor (8400 Series); Manufacturer: MURATA POWER SOLUTIONS; Manufacturer Part Number: 84103C; Power: 950mA; Resistance: 0.24R; Tolerance: ±10%; Part Number: IND_10UH_10%_MURATA-PS_8400; Component Kind: Standard; Component Type: Standard; Pin Count: 2; Value: 10uH; Status: None; Mounted: Yes; Socket: No; SMD: Yes; Sense: No; ComponentHeight: 2.9mm; HelpURL: \\cern.ch\dfs\Applications\Altium\Datasheets\IND_MURATA-PS_8400.pdf; Author: CERN DEM JLC; CreateDate: 02.07.2012; LatestRevisionDate: 02.07.2012
L5 = IND_47UH_10%_MURATA-PS_8400: Inductor With Core; Part Description: Miniature Surface Mount Power Inductor (8400 Series); Manufacturer: MURATA POWER SOLUTIONS; Manufacturer Part Number: 84473C; Power: 420mA; Resistance: 1.1R; Tolerance: ±10%; Part Number: IND_47UH_10%_MURATA-PS_8400; Component Kind: Standard; Component Type: Standard; Pin Count: 2; Value: 47uH; Status: None; Mounted: Yes; Socket: No; SMD: Yes; Sense: No; ComponentHeight: 2.9mm; HelpURL: \\cern.ch\dfs\Applications\Altium\Datasheets\IND_MURATA-PS_8400.pdf; Author: CERN DEM JLC; CreateDate: 21.09.2011; LatestRevisionDate: 21.09.2011
R19 = R0603_270K_1%_0.1W_100PPM: Resistor - 1%; Part Description: General Purpose Thick Film Chip Resistor; Manufacturer: GENERIC; Manufacturer1 Part Number: NRC06F2703TRF; Power: 0.1W; TC: ±100ppm/°C; PressFit: No; Part Number: R0603_270K_1%_0.1W_100PPM; Component Kind: Standard; Component Type: Standard; Pin Count: 2; Value: 270k; Status: Preferred; Tolerance: ±1%; Manufacturer Part Number: R0603_270K_1%_0.1W_100PPM; Case: 0603; Mounted: Yes; Sense: No; Socket: No; SMD: Yes; Manufacturer1 Example: NIC COMPONENT; Manufacturer1 ComponentHeight: 0.55mm; HelpURL: \\cern.ch\dfs\Applications\Altium\Datasheets\R0603_NIC_NRC.pdf; Author: CERN DEM JLC; CreateDate: 03.12.2007; LatestRevisionDate: 13.03.2008
R20 = R0603_82K_1%_0.1W_100PPM: Resistor - 1%; Part Description: General Purpose Thick Film Chip Resistor; Manufacturer: GENERIC; Manufacturer1 Part Number: NRC06F8202TRF; Power: 0.1W; TC: ±100ppm/°C; PressFit: No; Part Number: R0603_82K_1%_0.1W_100PPM; Component Kind: Standard; Component Type: Standard; Pin Count: 2; Value: 82k; Status: Preferred; Tolerance: ±1%; Manufacturer Part Number: R0603_82K_1%_0.1W_100PPM; Case: 0603; Mounted: Yes; Sense: No; Socket: No; SMD: Yes; Manufacturer1 Example: NIC COMPONENT; Manufacturer1 ComponentHeight: 0.55mm; HelpURL: \\cern.ch\dfs\Applications\Altium\Datasheets\R0603_NIC_NRC.pdf; Author: CERN DEM JLC; CreateDate: 03.12.2007; LatestRevisionDate: 13.03.2008
R21 R23 R26 = R0603_43K_1%_0.1W_100PPM: Resistor - 1%; Part Description: General Purpose Thick Film Chip Resistor; Manufacturer: GENERIC; Manufacturer1 Part Number: NRC06F4302TRF; Power: 0.1W; TC: ±100ppm/°C; PressFit: No; Part Number: R0603_43K_1%_0.1W_100PPM; Component Kind: Standard; Component Type: Standard; Pin Count: 2; Value: 43k; Status: Preferred; Tolerance: ±1%; Manufacturer Part Number: R0603_43K_1%_0.1W_100PPM; Case: 0603; Mounted: Yes; Sense: No; Socket: No; SMD: Yes; Manufacturer1 Example: NIC COMPONENT; Manufacturer1 ComponentHeight: 0.55mm; HelpURL: \\cern.ch\dfs\Applications\Altium\Datasheets\R0603_NIC_NRC.pdf; Author: CERN DEM JLC; CreateDate: 03.12.2007; LatestRevisionDate: 13.03.2008
R22 R27 = R0603_5K1_1%_0.1W_100PPM: Resistor - 1%; Part Description: General Purpose Thick Film Chip Resistor; Manufacturer: GENERIC; Manufacturer1 Part Number: NRC06F5101TRF; Power: 0.1W; TC: ±100ppm/°C; PressFit: No; Part Number: R0603_5K1_1%_0.1W_100PPM; Component Kind: Standard; Component Type: Standard; Pin Count: 2; Value: 5k1; Status: Preferred; Tolerance: ±1%; Manufacturer Part Number: R0603_5K1_1%_0.1W_100PPM; Case: 0603; Mounted: Yes; Sense: No; Socket: No; SMD: Yes; Manufacturer1 Example: NIC COMPONENT; Manufacturer1 ComponentHeight: 0.55mm; HelpURL: \\cern.ch\dfs\Applications\Altium\Datasheets\R0603_NIC_NRC.pdf; Author: CERN DEM JLC; CreateDate: 03.12.2007; LatestRevisionDate: 13.03.2008
R24 R25 = R0603_16K_1%_0.1W_100PPM: Resistor - 1%; Part Description: General Purpose Thick Film Chip Resistor; Manufacturer: GENERIC; Manufacturer1 Part Number: NRC06F1602TRF; Power: 0.1W; TC: ±100ppm/°C; PressFit: No; Part Number: R0603_16K_1%_0.1W_100PPM; Component Kind: Standard; Component Type: Standard; Pin Count: 2; Value: 16k; Status: Preferred; Tolerance: ±1%; Manufacturer Part Number: R0603_16K_1%_0.1W_100PPM; Case: 0603; Mounted: Yes; Sense: No; Socket: No; SMD: Yes; Manufacturer1 Example: NIC COMPONENT; Manufacturer1 ComponentHeight: 0.55mm; HelpURL: \\cern.ch\dfs\Applications\Altium\Datasheets\R0603_NIC_NRC.pdf; Author: CERN DEM JLC; CreateDate: 03.12.2007; LatestRevisionDate: 13.03.2008
R28 = R0603_1K1_1%_0.1W_100PPM: Resistor - 1%; Part Description: General Purpose Thick Film Chip Resistor; Manufacturer: GENERIC; Manufacturer1 Part Number: NRC06F1101TRF; Power: 0.1W; TC: ±100ppm/°C; PressFit: No; Part Number: R0603_1K1_1%_0.1W_100PPM; Component Kind: Standard; Component Type: Standard; Pin Count: 2; Value: 1k1; Status: Preferred; Tolerance: ±1%; Manufacturer Part Number: R0603_1K1_1%_0.1W_100PPM; Case: 0603; Mounted: Yes; Sense: No; Socket: No; SMD: Yes; Manufacturer1 Example: NIC COMPONENT; Manufacturer1 ComponentHeight: 0.55mm; HelpURL: \\cern.ch\dfs\Applications\Altium\Datasheets\R0603_NIC_NRC.pdf; Author: CERN DEM JLC; CreateDate: 03.12.2007; LatestRevisionDate: 13.03.2008
R29 = R0603_120R_1%_0.1W_100PPM: Resistor - 1%; Part Description: General Purpose Thick Film Chip Resistor; Manufacturer: GENERIC; Manufacturer1 Part Number: NRC06F1200TRF; Power: 0.1W; TC: ±100ppm/°C; PressFit: No; Part Number: R0603_120R_1%_0.1W_100PPM; Component Kind: Standard; Component Type: Standard; Pin Count: 2; Value: 120; Status: Preferred; Tolerance: ±1%; Manufacturer Part Number: R0603_120R_1%_0.1W_100PPM; Case: 0603; Mounted: Yes; Sense: No; Socket: No; SMD: Yes; Manufacturer1 Example: NIC COMPONENT; Manufacturer1 ComponentHeight: 0.55mm; HelpURL: \\cern.ch\dfs\Applications\Altium\Datasheets\R0603_NIC_NRC.pdf; Author: CERN DEM JLC; CreateDate: 03.12.2007; LatestRevisionDate: 13.03.2008
SW0 = B13AP: as SW1 on sheet OutputChannel; Supplier 1: Digi-Key; Manufacturer Part Number 1: B13AP; Stock 1: 542; Pricing 1: 1=3,70000, 10=3,31100, 25=3,14160, 50=2,98760, 100=2,84900, 250=2,72580, 500=2,49480, 1000=2,37160 (USD); RoHS: Yes; Mount: Through Hole,PCB; Number of Pins: 1; Contact Plating: Gold; Contact Material: Bronze,Gold; Min Operating Temperature: -30°C; Max Operating Temperature: 85°C; Throw Configuration: SPDT; Packaging: Bulk; Voltage Rating (DC): 28V; Orientation: Vertical; Package Quantity: 1; Switch Function: On-Off-On; Termination: Solder; Max Current Rating: 100mA; Max Voltage Rating (AC): 28V; Max Voltage Rating (DC): 28V; Contact Current Rating: 100mA; Length: 8.8mm; Depth: 6.8mm; Lead Free: Lead Free; REACH SVHC: No SVHC; ComponentLink1URL: https://datasheet.ciiva.com/5287/btoggles-28447-5287190.pdf?src-supplier=Mouser; ComponentLink1Description: https://datasheet.ciiva.com/5287/btoggles-28447-5287190.pdf?src-supplier=Mouser; ComponentLink2URL: https://datasheet.ciiva.com/14542/70192333-14542216.pdf?src-supplier=Allied+Electronics; ComponentLink2Description: https://datasheet.ciiva.com/14542/70192333-14542216.pdf?src-supplier=Allied+Electronics; Supplier Part Number 1: 360-1013-ND
TP12-TP17 = SMD_PAD_1.27X1.27MM: Part Description: 1.27mm x 1.27mm PCB Copper Area (SMD Test Point); Mounted: No; Part Number: SMD_PAD_1.27X1.27MM; Component Kind: Standard (No BOM); Component Type: Standard (No BOM); Pin Count: 1; Family: Test Point; Socket: No; SMD: Yes; Sense: No; Status: None; ComponentHeight: 0mm; HelpURL: Undefined; Author: CERN DEM JLC; CreateDate: 12.01.2008; LatestRevisionDate: 12.01.2008; PackageDescription: 1.27mm x 1.27mm PCB Copper Area (SMD Test Point)